# Altium schematic sheet CLKB_clocking_fpga.SchDoc
size A3
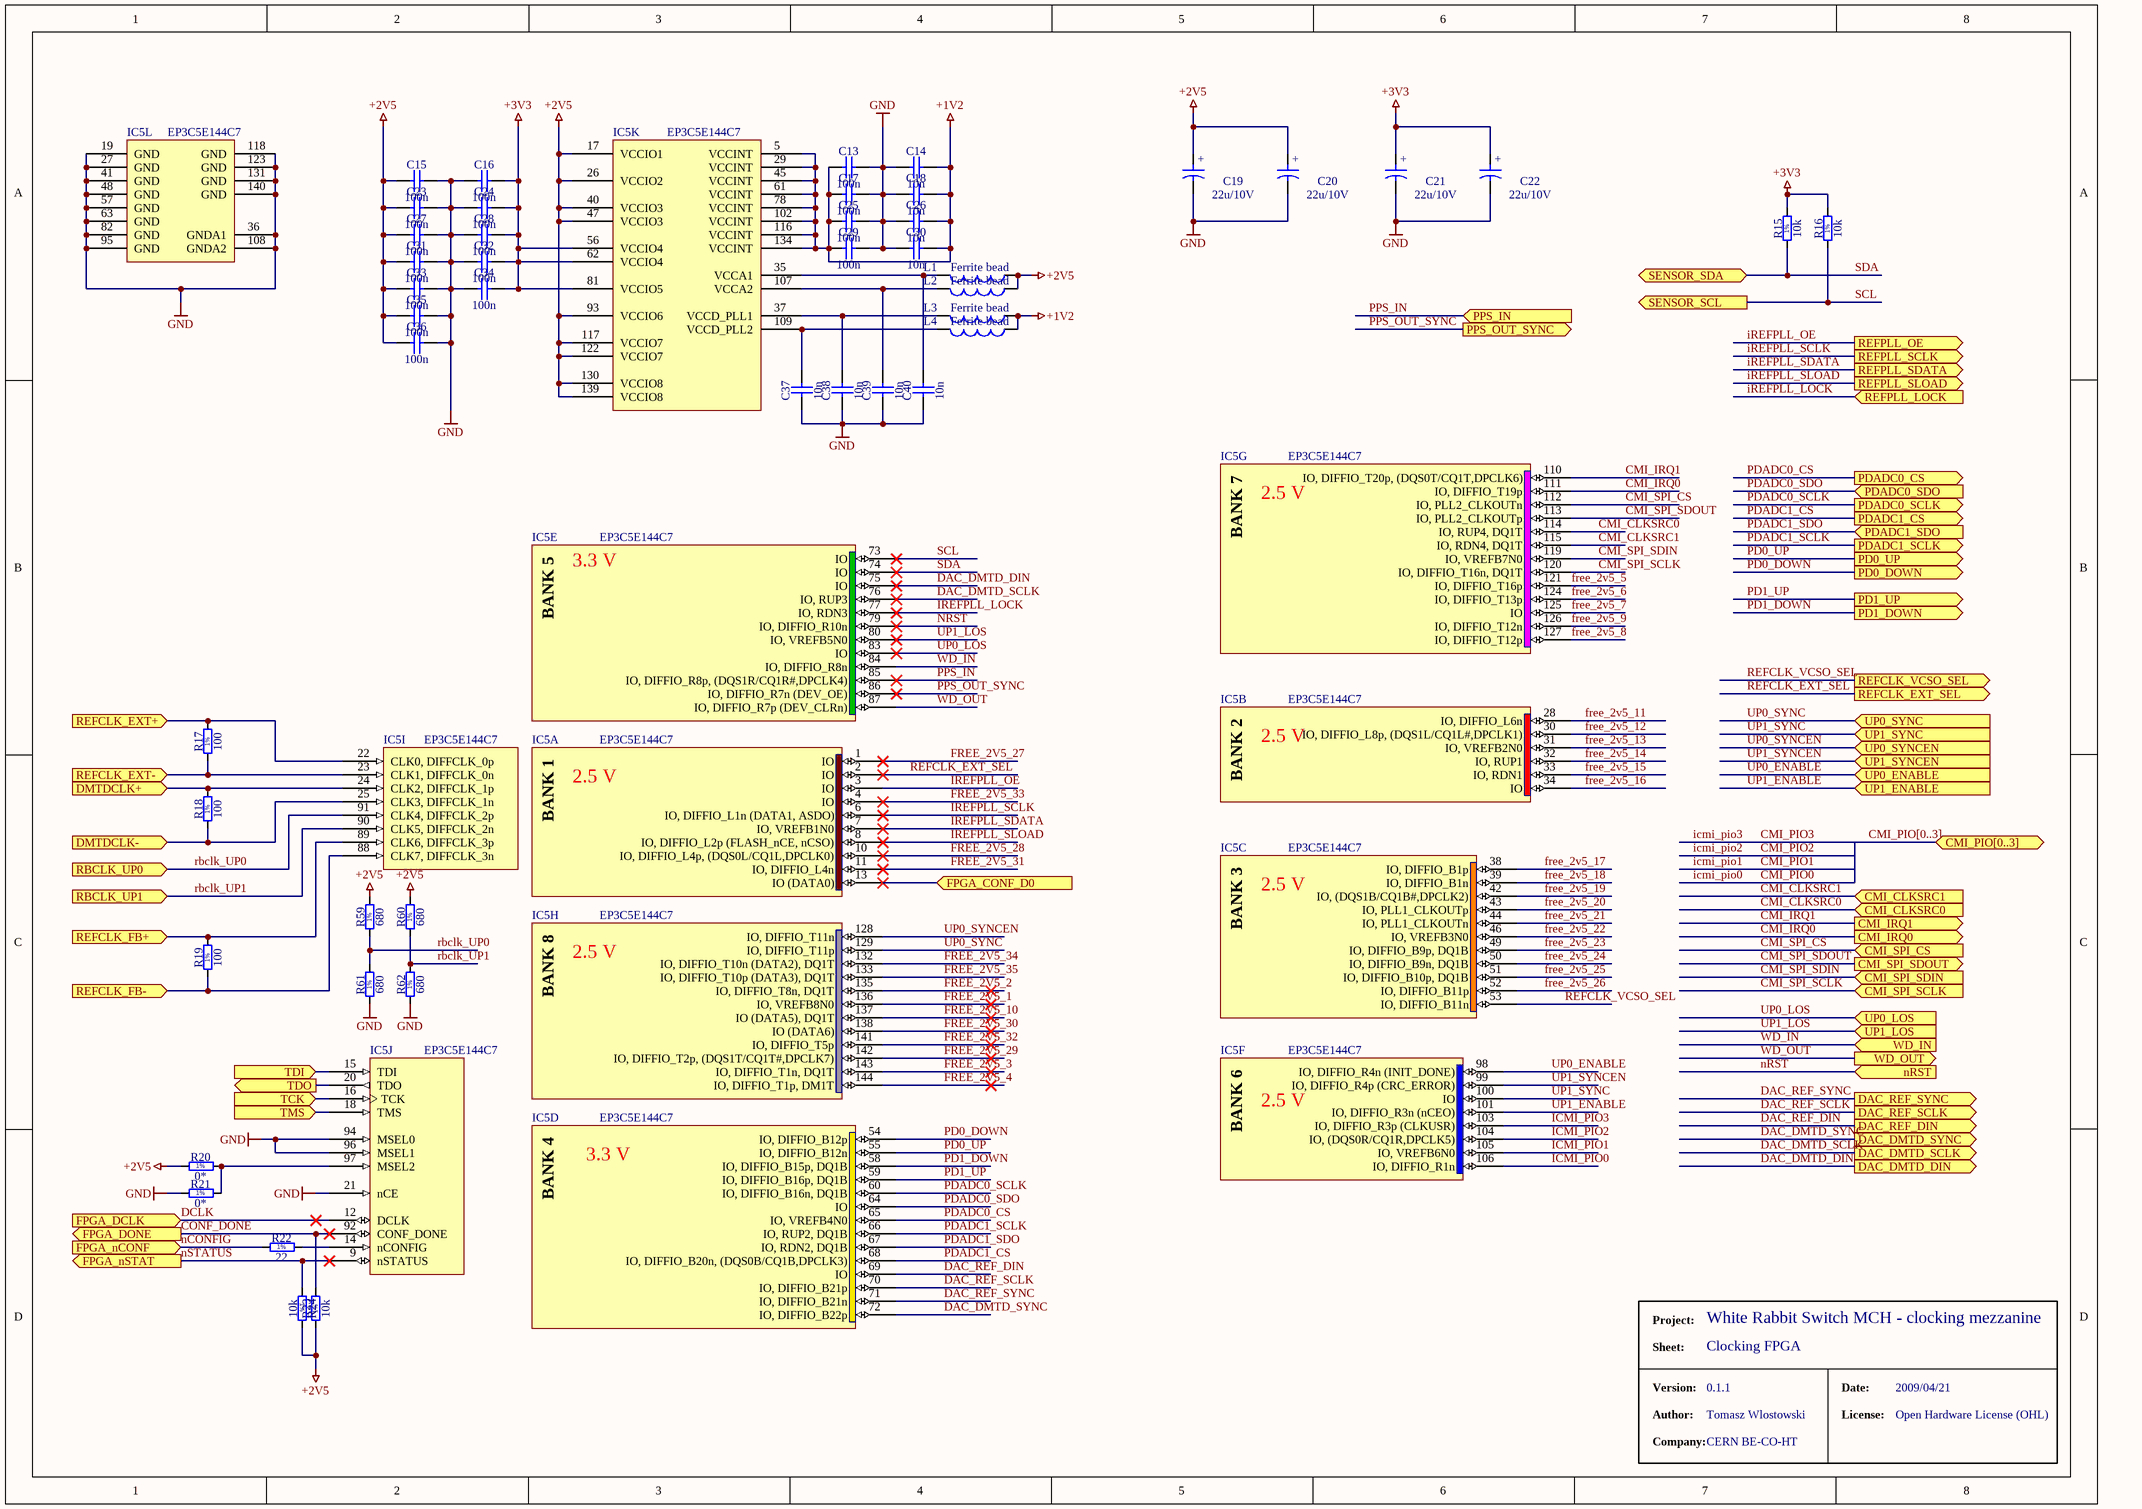
[diagram p0: CLKB_clocking_fpga.SchDoc]

## Parts
C13  100n  [CAPC1608X87N]
C14  10n  [CAPC1608X87N]
C15  100n  [CAPC1608X87N]
C16  100n  [CAPC1608X87N]
C17  100n  [CAPC1608X87N]
C18  10n  [CAPC1608X87N]
C19  22u/10V  [CAPMP3216X180N]
C20  22u/10V  [CAPMP3216X180N]
C21  22u/10V  [CAPMP3216X180N]
C22  22u/10V  [CAPMP3216X180N]
C23  100n  [CAPC1608X87N]
C24  100n  [CAPC1608X87N]
C25  100n  [CAPC1608X87N]
C26  10n  [CAPC1608X87N]
C27  100n  [CAPC1608X87N]
C28  100n  [CAPC1608X87N]
C29  100n  [CAPC1608X87N]
C30  10n  [CAPC1608X87N]
C31  100n  [CAPC1608X87N]
C32  100n  [CAPC1608X87N]
C33  100n  [CAPC1608X87N]
C34  100n  [CAPC1608X87N]
C35  100n  [CAPC1608X87N]
C36  100n  [CAPC1608X87N]
C37  10n  [CAPC1608X87N]
C38  10n  [CAPC1608X87N]
C39  10n  [CAPC1608X87N]
C40  10n  [CAPC1608X87N]
IC5  EP3C5E144C7  [EQFP144_N]  (parts A,B,C,D,E,F,G,H,I,J,K,L of 12)
L1  Ferrite bead  [L0603]
L2  Ferrite bead  [L0603]
L3  Ferrite bead  [L0603]
L4  Ferrite bead  [L0603]
R15  10k  [RESC1608X55N]
R16  10k  [RESC1608X55N]
R17  100  [RESC1608X55N]
R18  100  [RESC1608X55N]
R19  100  [RESC1608X55N]
R20  0*  [RESC1608X55N]
R21  0*  [RESC1608X55N]
R22  22  [RESC1608X55N]
R23  10k  [RESC1608X55N]
R24  10k  [RESC1608X55N]
R59  680  [RESC1608X55N]
R60  680  [RESC1608X55N]
R61  680  [RESC1608X55N]
R62  680  [RESC1608X55N]

## Ports
CMI_CLKSRC0 (in), CMI_CLKSRC1 (in), CMI_IRQ0 (out), CMI_IRQ1 (out), CMI_PIO[0..3] (bidir), CMI_SPI_CS (in), CMI_SPI_SCLK (in), CMI_SPI_SDIN (in), CMI_SPI_SDOUT (out), DAC_DMTD_DIN (out), DAC_DMTD_SCLK (out), DAC_DMTD_SYNC (out), DAC_REF_DIN (out), DAC_REF_SCLK (out), DAC_REF_SYNC (out), DMTDCLK+ (in), DMTDCLK- (in), FPGA_CONF_D0 (in), FPGA_DCLK (in), FPGA_DONE (out), FPGA_nCONF (in), FPGA_nSTAT (out), nRST (in), PD0_DOWN (out), PD0_UP (out), PD1_DOWN (out), PD1_UP (out), PDADC0_CS (out), PDADC0_SCLK (out), PDADC0_SDO (in), PDADC1_CS (out), PDADC1_SCLK (out), PDADC1_SDO (in), PPS_IN (in), PPS_OUT_SYNC (out), RBCLK_UP0 (in), RBCLK_UP1 (in), REFCLK_EXT+ (in), REFCLK_EXT- (in), REFCLK_EXT_SEL (out), REFCLK_FB+ (in), REFCLK_FB- (in), REFCLK_VCSO_SEL (out), REFPLL_LOCK (in), REFPLL_OE (out), REFPLL_SCLK (out), REFPLL_SDATA (out), REFPLL_SLOAD (out), SENSOR_SCL (out), SENSOR_SDA (bidir), TCK (in), TDI (in), TDO (out), TMS (in), UP0_ENABLE (in), UP0_LOS (in), UP0_SYNC (in), UP0_SYNCEN (in), UP1_ENABLE (in), UP1_LOS (in), UP1_SYNC (in), UP1_SYNCEN (in), WD_IN (in), WD_OUT (out)

## Nets
+1V2: C13.1 C14.2 C17.1 C18.2 C25.1 C26.2 C29.1 C30.2 IC5.5(VCCINT) IC5.29(VCCINT) IC5.45(VCCINT) IC5.61(VCCINT) IC5.78(VCCINT) IC5.102(VCCINT) IC5.116(VCCINT) IC5.134(VCCINT) L3.1 L4.1
+2V5: C15.1 C19.1 C20.1 C23.1 C27.1 C31.1 C33.1 C35.1 C36.1 IC5.17(VCCIO1) IC5.26(VCCIO2) IC5.40(VCCIO3) IC5.47(VCCIO3) IC5.93(VCCIO6) IC5.117(VCCIO7) IC5.122(VCCIO7) IC5.130(VCCIO8) IC5.139(VCCIO8) L1.1 L2.1 R20.1 R23.1 R24.2 R59.2 R60.2
+3V3: C16.2 C21.1 C22.1 C24.2 C28.2 C32.2 C34.2 IC5.56(VCCIO4) IC5.62(VCCIO4) IC5.81(VCCIO5) R15.2 R16.2
GND: C13.2 C14.1 C15.2 C16.1 C17.2 C18.1 C19.2 C20.2 C21.2 C22.2 C23.2 C24.1 C25.2 C26.1 C27.2 C28.1 C29.2 C30.1 C31.2 C32.1 C33.2 C34.1 C35.2 C36.2 C37.1 C38.1 C39.1 C40.1 IC5.19(GND) IC5.21(nCE) IC5.27(GND) IC5.36(GNDA1) IC5.41(GND) IC5.48(GND) IC5.57(GND) IC5.63(GND) IC5.82(GND) IC5.94(MSEL0) IC5.95(GND) IC5.96(MSEL1) IC5.108(GNDA2) IC5.118(GND) IC5.123(GND) IC5.131(GND) IC5.140(GND) R21.1 R61.1 R62.1
CMI_CLKSRC0: IC5.114(IO,_RUP4,_DQ1T) ; port CMI_CLKSRC0
CMI_CLKSRC1: IC5.115(IO,_RDN4,_DQ1T) ; port CMI_CLKSRC1
CMI_IRQ0: IC5.111(IO,_DIFFIO_T19p) ; port CMI_IRQ0
CMI_IRQ1: IC5.110(IO,_DIFFIO_T20p,_(DQS0T/CQ1T,DPCLK6)) ; port CMI_IRQ1
CMI_PIO0: IC5.106(IO,_DIFFIO_R1n)  [also labelled icmi_pio0]
CMI_PIO1: IC5.105(IO,_VREFB6N0)  [also labelled icmi_pio1]
CMI_PIO2: IC5.104(IO,_(DQS0R/CQ1R,DPCLK5))  [also labelled icmi_pio2]
CMI_PIO3: IC5.103(IO,_DIFFIO_R3p_(CLKUSR))  [also labelled icmi_pio3]
CMI_SPI_CS: IC5.112(IO,_PLL2_CLKOUTn) ; port CMI_SPI_CS
CMI_SPI_SCLK: IC5.120(IO,_DIFFIO_T16n,_DQ1T) ; port CMI_SPI_SCLK
CMI_SPI_SDIN: IC5.119(IO,_VREFB7N0) ; port CMI_SPI_SDIN
CMI_SPI_SDOUT: IC5.113(IO,_PLL2_CLKOUTp) ; port CMI_SPI_SDOUT
CONF_DONE: IC5.92(CONF_DONE) R23.2 ; port FPGA_DONE
DAC_DMTD_DIN: IC5.75(IO) ; port DAC_DMTD_DIN
DAC_DMTD_SCLK: IC5.76(IO,_RUP3) ; port DAC_DMTD_SCLK
DAC_DMTD_SYNC: IC5.72(IO,_DIFFIO_B22p) ; port DAC_DMTD_SYNC
DAC_REF_DIN: IC5.69(IO) ; port DAC_REF_DIN
DAC_REF_SCLK: IC5.70(IO,_DIFFIO_B21p) ; port DAC_REF_SCLK
DAC_REF_SYNC: IC5.71(IO,_DIFFIO_B21n) ; port DAC_REF_SYNC
DCLK: IC5.12(DCLK) ; port FPGA_DCLK
DMTDCLK+: IC5.24(CLK2,_DIFFCLK_1p) R18.2 ; port DMTDCLK+
DMTDCLK-: IC5.25(CLK3,_DIFFCLK_1n) R18.1 ; port DMTDCLK-
FPGA_CONF_D0: IC5.13(IO_(DATA0)) ; port FPGA_CONF_D0
FREE_2V5_1: IC5.136(IO,_VREFB8N0)
FREE_2V5_2: IC5.135(IO,_DIFFIO_T8n,_DQ1T)
FREE_2V5_3: IC5.143(IO,_DIFFIO_T1n,_DQ1T)
FREE_2V5_4: IC5.144(IO,_DIFFIO_T1p,_DM1T)
free_2v5_5: IC5.121(IO,_DIFFIO_T16p)
free_2v5_6: IC5.124(IO,_DIFFIO_T13p)
free_2v5_7: IC5.125(IO)
free_2v5_8: IC5.127(IO,_DIFFIO_T12p)
free_2v5_9: IC5.126(IO,_DIFFIO_T12n)
FREE_2V5_10: IC5.137(IO_(DATA5),_DQ1T)
free_2v5_11: IC5.28(IO,_DIFFIO_L6n)
free_2v5_12: IC5.30(IO,_DIFFIO_L8p,_(DQS1L/CQ1L#,DPCLK1))
free_2v5_13: IC5.31(IO,_VREFB2N0)
free_2v5_14: IC5.32(IO,_RUP1)
free_2v5_15: IC5.33(IO,_RDN1)
free_2v5_16: IC5.34(IO)
free_2v5_17: IC5.38(IO,_DIFFIO_B1p)
free_2v5_18: IC5.39(IO,_DIFFIO_B1n)
free_2v5_19: IC5.42(IO,_(DQS1B/CQ1B#,DPCLK2))
free_2v5_20: IC5.43(IO,_PLL1_CLKOUTp)
free_2v5_21: IC5.44(IO,_PLL1_CLKOUTn)
free_2v5_22: IC5.46(IO,_VREFB3N0)
free_2v5_23: IC5.49(IO,_DIFFIO_B9p,_DQ1B)
free_2v5_24: IC5.50(IO,_DIFFIO_B9n,_DQ1B)
free_2v5_25: IC5.51(IO,_DIFFIO_B10p,_DQ1B)
free_2v5_26: IC5.52(IO,_DIFFIO_B11p)
FREE_2V5_27: IC5.1(IO)
FREE_2V5_28: IC5.10(IO,_DIFFIO_L4p,_(DQS0L/CQ1L,DPCLK0))
FREE_2V5_29: IC5.142(IO,_DIFFIO_T2p,_(DQS1T/CQ1T#,DPCLK7))
FREE_2V5_30: IC5.138(IO_(DATA6))
FREE_2V5_31: IC5.11(IO,_DIFFIO_L4n)
FREE_2V5_32: IC5.141(IO,_DIFFIO_T5p)
FREE_2V5_33: IC5.4(IO)
FREE_2V5_34: IC5.132(IO,_DIFFIO_T10n_(DATA2),_DQ1T)
FREE_2V5_35: IC5.133(IO,_DIFFIO_T10p_(DATA3),_DQ1T)
iREFPLL_LOCK: IC5.77(IO,_RDN3) ; port REFPLL_LOCK
iREFPLL_OE: IC5.3(IO) ; port REFPLL_OE
iREFPLL_SCLK: IC5.6(IO,_DIFFIO_L1n_(DATA1,_ASDO)) ; port REFPLL_SCLK
iREFPLL_SDATA: IC5.7(IO,_VREFB1N0) ; port REFPLL_SDATA
iREFPLL_SLOAD: IC5.8(IO,_DIFFIO_L2p_(FLASH_nCE,_nCSO)) ; port REFPLL_SLOAD
nCONFIG: R22.1 ; port FPGA_nCONF
nRST: IC5.79(IO,_DIFFIO_R10n) ; port nRST
nSTATUS: IC5.9(nSTATUS) R24.1 ; port FPGA_nSTAT
PD0_DOWN: IC5.54(IO,_DIFFIO_B12p) ; port PD0_DOWN
PD0_UP: IC5.55(IO,_DIFFIO_B12n) ; port PD0_UP
PD1_DOWN: IC5.58(IO,_DIFFIO_B15p,_DQ1B) ; port PD1_DOWN
PD1_UP: IC5.59(IO,_DIFFIO_B16p,_DQ1B) ; port PD1_UP
PDADC0_CS: IC5.65(IO,_VREFB4N0) ; port PDADC0_CS
PDADC0_SCLK: IC5.60(IO,_DIFFIO_B16n,_DQ1B) ; port PDADC0_SCLK
PDADC0_SDO: IC5.64(IO) ; port PDADC0_SDO
PDADC1_CS: IC5.68(IO,_DIFFIO_B20n,_(DQS0B/CQ1B,DPCLK3)) ; port PDADC1_CS
PDADC1_SCLK: IC5.66(IO,_RUP2,_DQ1B) ; port PDADC1_SCLK
PDADC1_SDO: IC5.67(IO,_RDN2,_DQ1B) ; port PDADC1_SDO
PPS_IN: IC5.85(IO,_DIFFIO_R8p,_(DQS1R/CQ1R#,DPCLK4)) ; port PPS_IN
PPS_OUT_SYNC: IC5.86(IO,_DIFFIO_R7n_(DEV_OE)) ; port PPS_OUT_SYNC
rbclk_UP0: IC5.91(CLK4,_DIFFCLK_2p) R59.1 R61.2 ; port RBCLK_UP0
rbclk_UP1: IC5.90(CLK5,_DIFFCLK_2n) R60.1 R62.2 ; port RBCLK_UP1
REFCLK_EXT+: IC5.22(CLK0,_DIFFCLK_0p) R17.2 ; port REFCLK_EXT+
REFCLK_EXT-: IC5.23(CLK1,_DIFFCLK_0n) R17.1 ; port REFCLK_EXT-
REFCLK_EXT_SEL: IC5.2(IO) ; port REFCLK_EXT_SEL
REFCLK_FB+: IC5.89(CLK6,_DIFFCLK_3p) R19.2 ; port REFCLK_FB+
REFCLK_FB-: IC5.88(CLK7,_DIFFCLK_3n) R19.1 ; port REFCLK_FB-
REFCLK_VCSO_SEL: IC5.53(IO,_DIFFIO_B11n) ; port REFCLK_VCSO_SEL
SCL: IC5.73(IO) R16.1 ; port SENSOR_SCL
SDA: IC5.74(IO) R15.1 ; port SENSOR_SDA
TCK: IC5.16(TCK) ; port TCK
TDI: IC5.15(TDI) ; port TDI
TDO: IC5.20(TDO) ; port TDO
TMS: IC5.18(TMS) ; port TMS
UP0_ENABLE: IC5.98(IO,_DIFFIO_R4n_(INIT_DONE)) ; port UP0_ENABLE
UP0_LOS: IC5.83(IO) ; port UP0_LOS
UP0_SYNC: IC5.129(IO,_DIFFIO_T11p) ; port UP0_SYNC
UP0_SYNCEN: IC5.128(IO,_DIFFIO_T11n) ; port UP0_SYNCEN
UP1_ENABLE: IC5.101(IO,_DIFFIO_R3n_(nCEO)) ; port UP1_ENABLE
UP1_LOS: IC5.80(IO,_VREFB5N0) ; port UP1_LOS
UP1_SYNC: IC5.100(IO) ; port UP1_SYNC
UP1_SYNCEN: IC5.99(IO,_DIFFIO_R4p_(CRC_ERROR)) ; port UP1_SYNCEN
WD_IN: IC5.84(IO,_DIFFIO_R8n) ; port WD_IN
WD_OUT: IC5.87(IO,_DIFFIO_R7p_(DEV_CLRn)) ; port WD_OUT
NetC37_2: C37.2 IC5.109(VCCD_PLL2) L4.2
NetC38_2: C38.2 IC5.37(VCCD_PLL1) L3.2
NetC39_2: C39.2 IC5.107(VCCA2) L2.2
NetC40_2: C40.2 IC5.35(VCCA1) L1.2
NetIC5_14: IC5.14(nCONFIG) R22.2
NetIC5_97: IC5.97(MSEL2) R20.2 R21.2

## Buses and harness runs
bus CMI_PIO[0..3] = port CMI_PIO[0..3]

## Notes on the sheet
- 2.5 V
- 3.3 V
- Project:
- White Rabbit Switch MCH - clocking mezzanine
- Sheet:
- Version:
- Clocking FPGA
- 0.1.1
- Date:
- 2009/04/21
- Author:
- Company:
- Tomasz Wlostowski
- CERN BE-CO-HT
- License:
- Open Hardware License (OHL)
- (in symbol CTE3216-18_22UF_10V_10%) +
- (in symbol EP3C5E144C7, part A) BANK 1
- (in symbol EP3C5E144C7, part B) BANK 2
- (in symbol EP3C5E144C7, part C) BANK 3
- (in symbol EP3C5E144C7, part D) BANK 4
- (in symbol EP3C5E144C7, part E) BANK 5
- (in symbol EP3C5E144C7, part F) BANK 6
- (in symbol EP3C5E144C7, part G) BANK 7
- (in symbol EP3C5E144C7, part H) BANK 8
- (in symbol R0603_0R_JUMPER) 1%
- (in symbol R0603_10K_1%_0.1W_100PPM) 1%
- (in symbol R0603_22R_1%_0.1W_100PPM) 1%
- (in symbol R0603_100R_1%_0.1W_100PPM) 1%
- (in symbol R0603_680R_1%_0.1W_100PPM) 1%

## Library data of the parts
C13 C15-C17 C23-C25 C27-C29 C31-C36 = CC0603_100NF_50V_10%_X7R: Non-polarised capacitor; Part Description: SMD Multilayer Chip Ceramic Capacitor; Manufacturer: GENERIC; Manufacturer1 Part Number: 223858615649; Manufacturer1 Datasheet: \\cern.ch\dfs\Applications\Altium\Datasheets\CC0603_X7R_PHYCOMP.pdf; Value: 100nF; Voltage: 50V; TC: X7R; Tolerance: ±10%; Table: Capacitors SMD; Part Number: CC0603_100NF_50V_10%_X7R; Component Kind: Standard; Component Type: Standard; Designator: Capacitor - non polarized; Library Reference: Capacitor - non polarized; Pin Count: 2; Status: Preferred; Manufacturer Part Number: CC0603_100NF_50V_10%_X7R; Case: 0603; Mounted: Yes; Socket: No; SMD: Yes; Manufacturer1 Example: PHYCOMP; Manufacturer1 ComponentHeight: 0.87mm; HelpURL: \\cern.ch\dfs\Applications\Altium\Datasheets\CC0603_X7R_PHYCOMP.pdf; Author: CERN DEM JLC; CreateDate: 12/3/2007; LatestRevisionDate: 12/3/2007
C14 C18 C26 C30 C37-C40 = CC0603_10NF_50V_10%_X7R: Non-polarised capacitor; Part Description: SMD Multilayer Chip Ceramic Capacitor; Manufacturer: GENERIC; Manufacturer1 Part Number: 223858615636; Manufacturer1 Datasheet: \\cern.ch\dfs\Applications\Altium\Datasheets\CC0603_X7R_PHYCOMP.pdf; Value: 10nF; Voltage: 50V; TC: X7R; Tolerance: ±10%; Table: Capacitors SMD; Part Number: CC0603_10NF_50V_10%_X7R; Component Kind: Standard; Component Type: Standard; Designator: Capacitor - non polarized; Library Reference: Capacitor - non polarized; Pin Count: 2; Status: Preferred; Manufacturer Part Number: CC0603_10NF_50V_10%_X7R; Case: 0603; Mounted: Yes; Socket: No; SMD: Yes; Manufacturer1 Example: PHYCOMP; Manufacturer1 ComponentHeight: 0.87mm; HelpURL: \\cern.ch\dfs\Applications\Altium\Datasheets\CC0603_X7R_PHYCOMP.pdf; Author: CERN DEM JLC; CreateDate: 12/3/2007; LatestRevisionDate: 12/3/2007
C19-C22 = CTE3216-18_22UF_10V_10%: Polarised capacitor; Part Description: Solid Tantalum Chip Capacitor; Manufacturer: GENERIC; Manufacturer1 Part Number: TAJA226K010R; Manufacturer1 Datasheet: \\cern.ch\dfs\Applications\Altium\Datasheets\CTE_AVX_TAJ.pdf; Value: 22uF; Voltage: 10V; Tolerance: ±10%; Table: Capacitors SMD; Part Number: CTE3216-18_22UF_10V_10%; Component Kind: Standard; Component Type: Standard; Designator: Capacitor - polarized; Library Reference: Capacitor - polarized; Pin Count: 2; Status: Preferred; Manufacturer Part Number: CTE3216-18_22UF_10V_10%; Case: A; Mounted: Yes; Socket: No; SMD: Yes; Manufacturer1 Example: AVX; Manufacturer1 ComponentHeight: 1.8mm; HelpURL: \\cern.ch\dfs\Applications\Altium\Datasheets\CTE_AVX_TAJ.pdf; Author: CERN DEM JLC; CreateDate: 12/3/2007; LatestRevisionDate: 12/3/2007
IC5 = EP3C5E144C7: Cyclone III Family FPGA, 94 I/O Pins, 4 PLLs, 144-Pin EQFP, Speed Grade 7, Commercial Grade; Note: Exposed pad at the bottom of this package must be connected to PCB GND.; RefId: 1635055; Published: 14-Mar-2008; DatasheetVersion: ver1.2, Sep-2007; PackageVersion: ver14.8, Oct-2007; PackageReference: EQFP144; Publisher: Altium Limited; PackageDescription: 144-Pin Plastic Enhanced Quad Flat Pack (EQFP144) - Wire Bond; Code_JEDEC: MS-026-BFB; ComponentLink1Description: Manufacturer Link; ComponentLink1URL: http://www.altera.com/; ComponentLink2Description: Handbook (7.86MB); ComponentLink2URL: http://www.altera.com/literature/hb/cyc3/cyclone3_handbook.pdf; ComponentLink3Description: Packaging Specification; ComponentLink3URL: http://www.altera.com/literature/ds/dspkg.pdf; Supplier: Farnell
L1-L4 = Inductor: Code_IEC: 1005; Published: 8-Jun-2000; LatestRevisionDate: 17-Jul-2002; LatestRevisionNote: Re-released for DXP Platform.; PackageReference: 0402-A; Publisher: Altium Limited; Code_JEITA: 0402
R15 R16 R23 R24 = R0603_10K_1%_0.1W_100PPM: Resistor - 1%; Part Description: General Purpose Thick Film Chip Resistor; Manufacturer: GENERIC; Manufacturer1 Part Number: NRC06F1002TRF; Manufacturer1 Datasheet: \\cern.ch\dfs\Applications\Altium\Datasheets\R0603_NIC_NRC.pdf; Power: 0.1W; TC: ±100ppm/°C; Table: Resistors SMD; Part Number: R0603_10K_1%_0.1W_100PPM; Component Kind: Standard; Component Type: Standard; Designator: Resistor - 1%; Library Reference: Resistor - 1%; Pin Count: 2; Value: 10k; Status: Preferred; Tolerance: ±1%; Manufacturer Part Number: R0603_10K_1%_0.1W_100PPM; Case: 0603; Mounted: Yes; Socket: No; SMD: Yes; Manufacturer1 Example: NIC COMPONENT; Manufacturer1 ComponentHeight: 0.55mm; HelpURL: \\cern.ch\dfs\Applications\Altium\Datasheets\R0603_NIC_NRC.pdf; Author: CERN DEM JLC; CreateDate: 12/3/2007; LatestRevisionDate: 3/13/2008
R17-R19 = R0603_100R_1%_0.1W_100PPM: Resistor - 1%; Part Description: General Purpose Thick Film Chip Resistor; Manufacturer: GENERIC; Manufacturer1 Part Number: NRC06F4700TRF; Manufacturer1 Datasheet: \\cern.ch\dfs\Applications\Altium\Datasheets\R0603_NIC_NRC.pdf; Power: 0.1W; TC: ±100ppm/°C; Table: Resistors SMD; Part Number: R0603_100R_1%_0.1W_100PPM; Component Kind: Standard; Component Type: Standard; Designator: Resistor - 1%; Library Reference: Resistor - 1%; Pin Count: 2; Value: 100; Status: Preferred; Tolerance: ±1%; Manufacturer Part Number: R0603_100R_1%_0.1W_100PPM; Case: 0603; Mounted: Yes; Socket: No; SMD: Yes; Manufacturer1 Example: NIC COMPONENT; Manufacturer1 ComponentHeight: 0.55mm; HelpURL: \\cern.ch\dfs\Applications\Altium\Datasheets\R0603_NIC_NRC.pdf; Author: CERN DEM JLC; CreateDate: 12/3/2007; LatestRevisionDate: 3/13/2008
R20 R21 = R0603_0R_JUMPER: Resistor - 1%; Part Description: 1A (0.05R Max DC Resistance) Zero Ohm Jumper; Manufacturer: GENERIC; Manufacturer1 Part Number: NRC06Z0; Manufacturer1 Datasheet: \\cern.ch\dfs\Applications\Altium\Datasheets\R0603_NIC_NRC.pdf; Value: 0; Table: Resistors SMD; Part Number: R0603_0R_JUMPER; Component Kind: Standard; Component Type: Standard; Designator: Resistor - 1%; Library Reference: Resistor - 1%; Pin Count: 2; Status: Preferred; Manufacturer Part Number: R0603_0R_JUMPER; Case: 0603; Mounted: Yes; Socket: No; SMD: Yes; Manufacturer1 Example: NIC COMPONENT; Manufacturer1 ComponentHeight: 0.55mm; HelpURL: \\cern.ch\dfs\Applications\Altium\Datasheets\R0603_NIC_NRC.pdf; Author: CERN DEM JLC; CreateDate: 12/3/2007; LatestRevisionDate: 3/13/2008
R22 = R0603_22R_1%_0.1W_100PPM: Resistor - 1%; Part Description: General Purpose Thick Film Chip Resistor; Manufacturer: GENERIC; Manufacturer1 Part Number: NRC06F22R0TRF; Manufacturer1 Datasheet: \\cern.ch\dfs\Applications\Altium\Datasheets\R0603_NIC_NRC.pdf; Power: 0.1W; TC: ±100ppm/°C; Table: Resistors SMD; Part Number: R0603_22R_1%_0.1W_100PPM; Component Kind: Standard; Component Type: Standard; Designator: Resistor - 1%; Library Reference: Resistor - 1%; Pin Count: 2; Value: 22; Status: Preferred; Tolerance: ±1%; Manufacturer Part Number: R0603_22R_1%_0.1W_100PPM; Case: 0603; Mounted: Yes; Socket: No; SMD: Yes; Manufacturer1 Example: NIC COMPONENT; Manufacturer1 ComponentHeight: 0.55mm; HelpURL: \\cern.ch\dfs\Applications\Altium\Datasheets\R0603_NIC_NRC.pdf; Author: CERN DEM JLC; CreateDate: 12/3/2007; LatestRevisionDate: 3/13/2008
R59-R62 = R0603_680R_1%_0.1W_100PPM: Resistor - 1%; Part Description: General Purpose Thick Film Chip Resistor; Manufacturer: GENERIC; Manufacturer1 Part Number: NRC06F6800TRF; Manufacturer1 Datasheet: \\cern.ch\dfs\Applications\Altium\Datasheets\R0603_NIC_NRC.pdf; Power: 0.1W; TC: ±100ppm/°C; Table: Resistors SMD; Part Number: R0603_680R_1%_0.1W_100PPM; Component Kind: Standard; Component Type: Standard; Designator: Resistor - 1%; Library Reference: Resistor - 1%; Pin Count: 2; Value: 680; Status: Preferred; Tolerance: ±1%; Manufacturer Part Number: R0603_680R_1%_0.1W_100PPM; Case: 0603; Mounted: Yes; Socket: No; SMD: Yes; Manufacturer1 Example: NIC COMPONENT; Manufacturer1 ComponentHeight: 0.55mm; HelpURL: \\cern.ch\dfs\Applications\Altium\Datasheets\R0603_NIC_NRC.pdf; Author: CERN DEM JLC; CreateDate: 12/3/2007; LatestRevisionDate: 3/13/2008